# Altium schematic sheet MavSword_V1.0.SchDoc: MavSword
size A2; Author: AwesomeOY; DocumentNumber: 1; Revision: V1.0; SheetNumber: 1; SheetTotal: MavSword
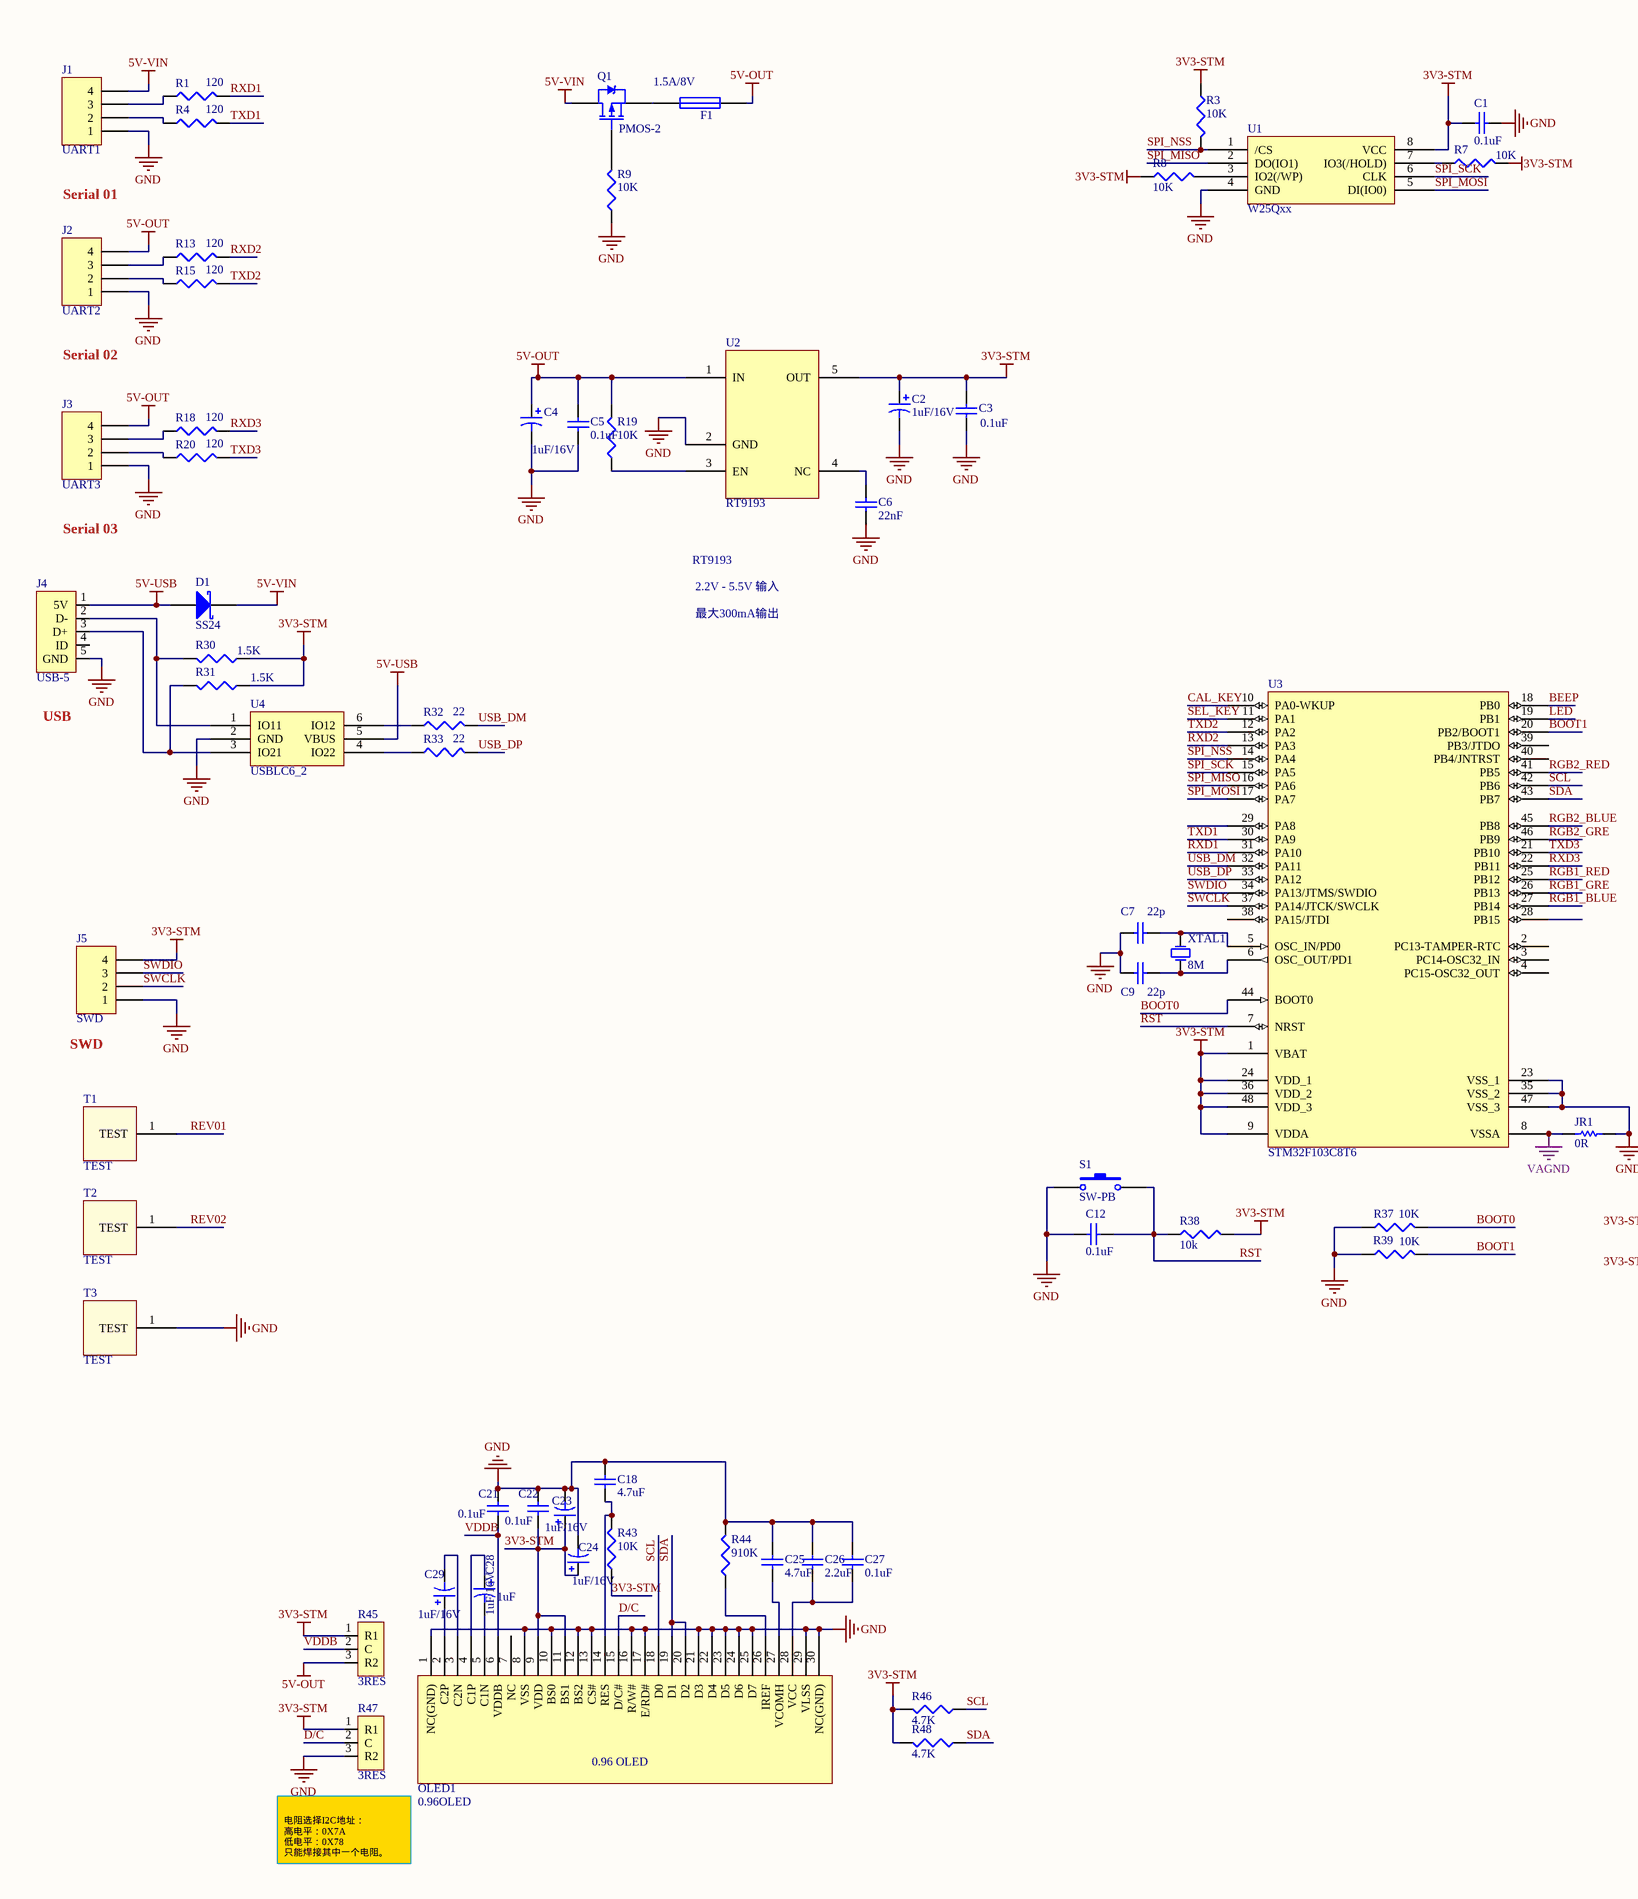
[diagram p0: MavSword_V1.0.SchDoc, left]
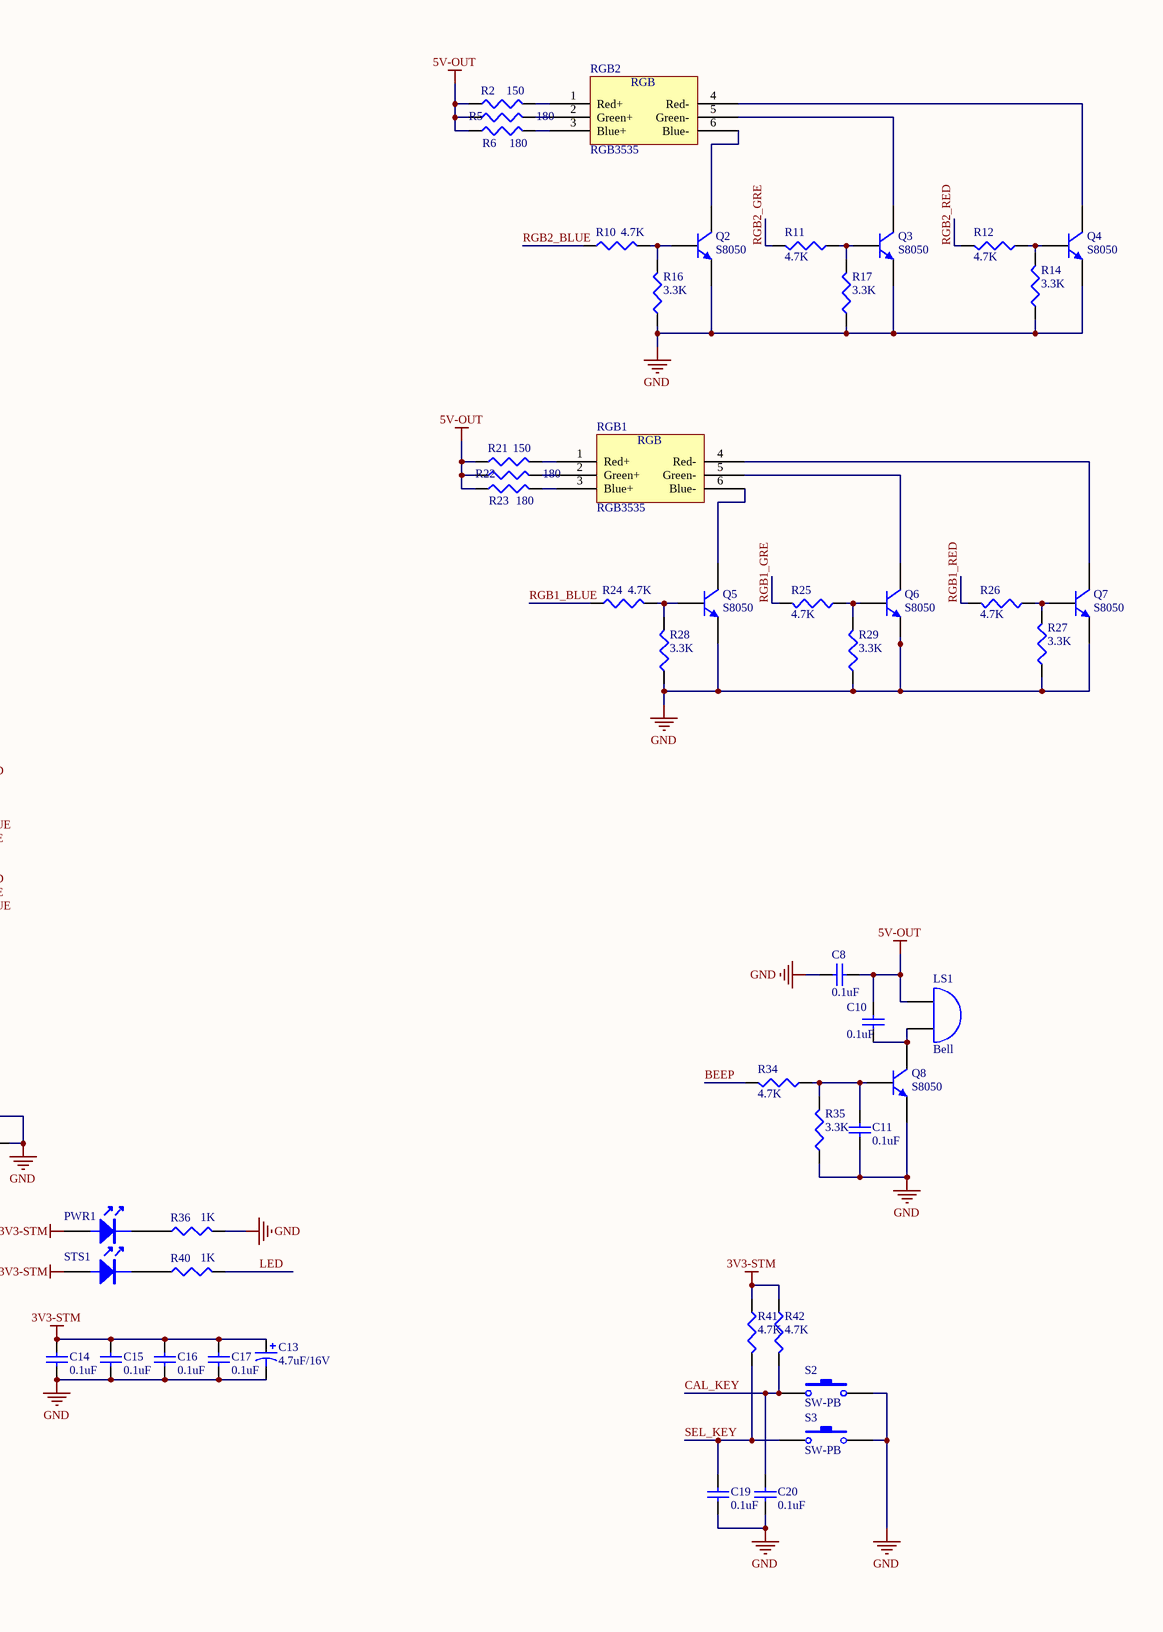
[diagram p1: MavSword_V1.0.SchDoc, right]

## Parts
C1  0.1uF  [C0603B]
C2  1uF/16V  [C0603B]
C3  0.1uF  [C0603B]
C4  1uF/16V  [C0603B]
C5  0.1uF  [C0603B]
C6  22nF  [C0603B]
C7  22p  [C0603B]
C8  0.1uF  [C0603B]
C9  22p  [C0603B]
C10  0.1uF  [C0603B]
C11  0.1uF  [C0603B]
C12  0.1uF  [C0603B]
C13  4.7uF/16V  [C0603B]
C14  0.1uF  [C0603B]
C15  0.1uF  [C0603B]
C16  0.1uF  [C0603B]
C17  0.1uF  [C0603B]
C18  4.7uF  [C0603B]
C19  0.1uF  [C0603B]
C20  0.1uF  [C0603B]
C21  0.1uF  [C0603B]
C22  value 1uF/16V  [C0603B]  (hidden comment: 0.1uF)
C23  0.1uF  [C0603B]
C24  value 1uF/16V  [C0603B]  (hidden comment: Cap Pol1)
C25  4.7uF  [C0603B]
C26  2.2uF  [C0603B]
C27  0.1uF  [C0603B]
C28  1uF  value 1uF/16V  [C0603B]
C29  value 1uF/16V  [C0603B]  (hidden comment: Cap Pol1)
D1  SS24  [D1812]
F1  1.5A/8V  [1812]
J1  UART1  [SIPA4-1.27-SMT-H]
J2  UART2  [SIPA4-1.27-SMT-H]
J3  UART3  [SIPA4-1.27-SMT-H]
J4  USB-5  [MICRO-USB]
J5  SWD  [SIP4-1.27]
JR1  0R  [R0603B]
LS1  Bell  [BEEP12*7.5]
OLED1  0.96OLED  [0.96OLED]
PWR1  LED  [LED0805R]  (value not drawn)
Q1  PMOS-2  [SOT-23-3]
Q2  S8050  [SOT-23-3]
Q3  S8050  [SOT-23-3]
Q4  S8050  [SOT-23-3]
Q5  S8050  [SOT-23-3]
Q6  S8050  [SOT-23-3]
Q7  S8050  [SOT-23-3]
Q8  S8050  [SOT-23-3]
R1  120  [R0603B]
R2  150  [R0603B]
R3  10K  [R0603B]
R4  120  [R0603B]
R5  180  [R0603B]
R6  180  [R0603B]
R7  10K  [R0603B]
R8  10K  [R0603B]
R9  10K  [R0603B]
R10  4.7K  [R0603B]
R11  4.7K  [R0603B]
R12  4.7K  [R0603B]
R13  120  [R0603B]
R14  3.3K  [R0603B]
R15  120  [R0603B]
R16  3.3K  [R0603B]
R17  3.3K  [R0603B]
R18  120  [R0603B]
R19  10K  [R0603B]
R20  120  [R0603B]
R21  150  [R0603B]
R22  180  [R0603B]
R23  180  [R0603B]
R24  4.7K  [R0603B]
R25  4.7K  [R0603B]
R26  4.7K  [R0603B]
R27  3.3K  [R0603B]
R28  3.3K  [R0603B]
R29  3.3K  [R0603B]
R30  1.5K  [R0603B]
R31  1.5K  [R0603B]
R32  22  [R0603B]
R33  22  [R0603B]
R34  4.7K  [R0603B]
R35  3.3K  [R0603B]
R36  1K  [R0603B]
R37  10K  [R0603B]
R38  10k  [R0603B]
R39  10K  [R0603B]
R40  1K  [R0603B]
R41  4.7K  [R0603B]
R42  4.7K  [R0603B]
R43  10K  [R0603B]
R44  910K  [R0603B]
R45  3RES  [3JUMP0603*2]
R46  4.7K  [R0603B]
R47  3RES  [3JUMP0603*2]
R48  4.7K  [R0603B]
RGB1  RGB3535  [RGB3535]
RGB2  RGB3535  [RGB3535]
S1  SW-PB  [SW2PIN_8.2*3.5]
S2  SW-PB  [SW4PIN_9.2*6.15*9]
S3  SW-PB  [SW4PIN_9.2*6.15*9]
STS1  LED  [LED0805G]  (value not drawn)
T1  TEST  [TEST_POINT]
T2  TEST  [TEST_POINT]
T3  TEST  [TEST_POINT]
U1  W25Qxx  [SOIC-8_208mil]
U2  RT9193  [SOT23-5]
U3  STM32F103C8T6  [LQFP48_M_STM32]
U4  USBLC6_2  [SOT-23-6]
XTAL1  8M  [XL5032]

## Nets
3V3-STM: C1.2 C2.1 C3.1 C13.1 C14.2 C15.2 C16.2 C17.2 C22.1 C23.1 C24.1 J5.4 OLED1.9(VDD) OLED1.11(BS1) PWR1.1 R3.1 R7.2 R8.1 R30.1 R31.1 R38.1 R41.1 R42.1 R43.1 R45.1(R1) R46.2 R47.1(R1) R48.2 STS1.1 U1.8(VCC) U2.5(OUT) U3.1(VBAT) U3.9(VDDA) U3.24(VDD_1) U3.36(VDD_2) U3.48(VDD_3)
5V-OUT: C4.1 C5.2 C8.2 C10.2 F1.2 J2.4 J3.4 LS1.1(A) R2.1 R5.1 R6.1 R19.2 R21.1 R22.1 R23.1 R45.3(R2) U2.1(IN)
5V-USB: D1.1(A) J4.1(5V) U4.5(VBUS)
5V-VIN: D1.2(K) J1.4 Q1.2(D)
GND: C1.1 C2.2 C3.2 C4.2 C5.1 C6.1 C7.2 C8.1 C9.2 C11.1 C12.1 C13.2 C14.1 C15.1 C16.1 C17.1 C18.2 C19.1 C20.1 C21.2 C22.2 C23.2 C24.2 C25.2 C26.2 C27.1 J1.1 J2.1 J3.1 J4.5(GND) J5.1 JR1.2 OLED1.1(NC(GND)) OLED1.8(VSS) OLED1.10(BS0) OLED1.12(BS2) OLED1.13(CS#) OLED1.16(R/W#) OLED1.17(E/RD#) OLED1.21(D3) OLED1.22(D4) OLED1.23(D5) OLED1.24(D6) OLED1.25(D7) OLED1.29(VLSS) OLED1.30(NC(GND)) Q2.3(E) Q3.3(E) Q4.3(E) Q5.3(E) Q6.3(E) Q7.3(E) Q8.3(E) R9.1 R14.1 R16.1 R17.1 R27.1 R28.1 R29.1 R35.1 R36.2 R37.1 R39.1 R44.2 R47.3(R2) S1.1 S2.2 S3.2 T3.1(TEST) U1.4(GND) U2.2(GND) U3.23(VSS_1) U3.35(VSS_2) U3.47(VSS_3) U4.2(GND)
VAGND: JR1.1 U3.8(VSSA)
BEEP: R34.2 U3.18(PB0)
BOOT0: R37.2 U3.44(BOOT0)
BOOT1: R39.2 U3.20(PB2/BOOT1)
CAL_KEY: C20.2 R42.2 S2.1 U3.10(PA0-WKUP)
D/C: OLED1.15(D/C#) R47.2(C)
LED: R40.2 U3.19(PB1)
REV01: T1.1(TEST)
REV02: T2.1(TEST)
RGB1_BLUE: R24.1 U3.27(PB14)
RGB1_GRE: R25.2 U3.26(PB13)
RGB1_RED: R26.2 U3.25(PB12)
RGB2_BLUE: R10.1 U3.45(PB8)
RGB2_GRE: R11.2 U3.46(PB9)
RGB2_RED: R12.2 U3.41(PB5)
RST: C12.2 R38.2 S1.2 U3.7(NRST)
RXD1: R1.2 U3.31(PA10)
RXD2: R13.2 U3.13(PA3)
RXD3: R18.2 U3.22(PB11)
SCL: OLED1.18(D0) R46.1 U3.42(PB6)
SDA: OLED1.19(D1) OLED1.20(D2) R48.1 U3.43(PB7)
SEL_KEY: C19.2 R41.2 S3.1 U3.11(PA1)
SPI_MISO: U1.2(DO(IO1)) U3.16(PA6)
SPI_MOSI: U1.5(DI(IO0)) U3.17(PA7)
SPI_NSS: R3.2 U1.1(/CS) U3.14(PA4)
SPI_SCK: U1.6(CLK) U3.15(PA5)
SWCLK: J5.2 U3.37(PA14/JTCK/SWCLK)
SWDIO: J5.3 U3.34(PA13/JTMS/SWDIO)
TXD1: R4.2 U3.30(PA9)
TXD2: R15.2 U3.12(PA2)
TXD3: R20.2 U3.21(PB10)
USB_DM: R32.2 U3.32(PA11)
USB_DP: R33.2 U3.33(PA12)
VDDB: C21.1 OLED1.6(VDDB) R45.2(C)
NetC6_2: C6.2 U2.4(NC)
NetC7_1: C7.1 U3.5(OSC_IN/PD0) XTAL1.2(OSC2)
NetC9_1: C9.1 U3.6(OSC_OUT/PD1) XTAL1.1(OSC1)
NetC10_1: C10.1 LS1.2(B) Q8.2(C)
NetC11_2: C11.2 Q8.1(B) R34.1 R35.2
NetC18_1: C18.1 OLED1.14(RES) R43.2
NetC25_1: C25.1 OLED1.27(VCOMH)
NetC26_1: C26.1 C27.2 OLED1.28(VCC)
NetC28_1: C28.1 OLED1.4(C1P)
NetC28_2: C28.2 OLED1.5(C1N)
NetC29_1: C29.1 OLED1.2(C2P)
NetC29_2: C29.2 OLED1.3(C2N)
NetF1_1: F1.1 Q1.3(S)
NetJ1_2: J1.2 R4.1
NetJ1_3: J1.3 R1.1
NetJ2_2: J2.2 R15.1
NetJ2_3: J2.3 R13.1
NetJ3_2: J3.2 R20.1
NetJ3_3: J3.3 R18.1
NetJ4_2: J4.2(D-) R30.2 U4.1(IO11)
NetJ4_3: J4.3(D+) R31.2 U4.3(IO21)
NetOLED1_26: OLED1.26(IREF) R44.1
NetPWR1_2: PWR1.2 R36.1
NetQ1_1: Q1.1(G) R9.2
NetQ2_1: Q2.1(B) R10.2 R16.2
NetQ2_2: Q2.2(C) RGB2.6(Blue-)
NetQ3_1: Q3.1(B) R11.1 R17.2
NetQ3_2: Q3.2(C) RGB2.5(Green-)
NetQ4_1: Q4.1(B) R12.1 R14.2
NetQ4_2: Q4.2(C) RGB2.4(Red-)
NetQ5_1: Q5.1(B) R24.2 R28.2
NetQ5_2: Q5.2(C) RGB1.6(Blue-)
NetQ6_1: Q6.1(B) R25.1 R29.2
NetQ6_2: Q6.2(C) RGB1.5(Green-)
NetQ7_1: Q7.1(B) R26.1 R27.2
NetQ7_2: Q7.2(C) RGB1.4(Red-)
NetR2_2: R2.2 RGB2.1(Red+)
NetR5_2: R5.2 RGB2.2(Green+)
NetR6_2: R6.2 RGB2.3(Blue+)
NetR7_1: R7.1 U1.7(IO3(/HOLD))
NetR8_2: R8.2 U1.3(IO2(/WP))
NetR19_1: R19.1 U2.3(EN)
NetR21_2: R21.2 RGB1.1(Red+)
NetR22_2: R22.2 RGB1.2(Green+)
NetR23_2: R23.2 RGB1.3(Blue+)
NetR32_1: R32.1 U4.6(IO12)
NetR33_1: R33.1 U4.4(IO22)
NetR40_1: R40.1 STS1.2

Not connected (* = marked no-connect by the designer): J4 4(ID); OLED1 7(NC); U3 2(PC13-TAMPER-RTC) 3(PC14-OSC32_IN) 4(PC15-OSC32_OUT) 28(PB15) 29(PA8) 38(PA15/JTDI) 39(PB3/JTDO) 40(PB4/JNTRST)

## Notes on the sheet
- Serial 01
- Serial 02
- Serial 03
- RT9193
  2.2V - 5.5V 输入
  最大300mA输出
- (near J4) USB
- (near J5) SWD
- (near R47) 电阻选择I2C地址：
  高电平：0X7A
  低电平：0X78
  只能焊接其中一个电阻。
- Title
- Size:
- Date:
- File:
- A2
- Number:
- Time:
- Revision:
- Sheet
- of
- (in symbol 0.96OLED) 0.96 OLED
- (in symbol RGB3535) RGB

## Library data of the parts
C1 C3 C5 C6 C8 C10-C12 C14-C17 C19-C21 C23 C27 = Cap: Capacitor; Published: 8-Jun-2000; LatestRevisionDate: 17-Jul-2002; LatestRevisionNote: Re-released for DXP Platform.; PackageReference: RAD-0.3; Publisher: Altium Limited
  C1 C3 C5 C8 C10-C12 C14-C17 C19-C21 C23 C27: Value: 0.1uF
  C6: Value: 22nF
C2 C4 C13 C22 C24 C28 C29 = Cap Pol1: Polarized Capacitor (Radial); Published: 8-Jun-2000; LatestRevisionDate: 17-Jul-2002; LatestRevisionNote: Re-released for DXP Platform.; PackageReference: RB7.6-15; Publisher: Altium Limited
  C2 C4: Value: 1uF/16V
  C13: Value: 4.7uF/16V
  C22 C24 C28 C29: PackageDescription: Polarized Capacitor (Radial); 2 Leads
C7 C9 = Cap: Capacitor; Value: 22pF; Published: 8-Jun-2000; LatestRevisionDate: 17-Jul-2002; LatestRevisionNote: Re-released for DXP Platform.; PackageReference: RAD-0.3; Publisher: Altium Limited
C18 C25 = Cap: Capacitor; Value: 4.7uF/16V; Published: 8-Jun-2000; LatestRevisionDate: 17-Jul-2002; LatestRevisionNote: Re-released for DXP Platform.; PackageReference: RAD-0.3; Publisher: Altium Limited
C26 = Cap: Capacitor; Value: 2.2uF/16V; Published: 8-Jun-2000; LatestRevisionDate: 17-Jul-2002; LatestRevisionNote: Re-released for DXP Platform.; PackageReference: RAD-0.3; Publisher: Altium Limited
D1 = D Schottky: Schottky Diode; Published: 8-Jun-2000; LatestRevisionDate: 17-Jul-2002; LatestRevisionNote: Re-released for DXP Platform.; PackageReference: SMB; Publisher: Altium Limited; PackageDescription: DO-214-AA/SMB; 2 C-Bend Leads; Body 5.3 x 3.6 mm, inc. leads (LxW); Code_JEDEC: DO-214-AA
F1 = Fuse 1: Fuse; Published: 8-Jun-2000; LatestRevisionDate: 17-Jul-2002; LatestRevisionNote: Re-released for DXP Platform.; PackageReference: PIN-W2/E2.8; Publisher: Altium Limited; PackageDescription: Thru-Hole; 2 Leads
J1-J3 J5 = Header 4: Header, 4-Pin; LatestRevisionDate: 17-Jul-2002; LatestRevisionNote: Re-released for DXP Platform.; Publisher: Altium Limited
J4 = USB5
JR1 = Res1: Resistor; Value: 0; Published: 8-Jun-2000; LatestRevisionDate: 17-Jul-2002; LatestRevisionNote: Re-released for DXP Platform.; PackageReference: AXIAL-0.3; Publisher: Altium Limited; PackageDescription: Axial Device, Thru-Hole; 2 Leads; 0.3 in Pin Spacing
LS1 = Bell: Electrical Bell; Published: 24-Mar-1999; LatestRevisionDate: 17-Jul-2002; LatestRevisionNote: Re-released for DXP Platform.; PackageReference: PIN2; Publisher: Altium Limited
Q1 = PMOS-2: P-Channel Power MOSFET; Note: Pin 4 not drawn and electrically connected to Pin 2.; Published: 8-Jun-2000; LatestRevisionDate: 17-Jul-2002; LatestRevisionNote: Re-released for DXP Platform.; DatasheetVersion: PD-9.390D; PackageVersion: Feb-1997; PackageReference: TO-220AB; Publisher: Altium Limited; PackageDescription: TO, Thru-Hole, Vertical, Heatsink Mounted; 3 In-Line Leads; Pitch 2.54 mm; ComponentLink1Description: Manufacturer Link; ComponentLink1URL: http://www.irf.com/
Q2-Q8 = NPN: NPN Bipolar Transistor; Published: 8-Jun-2000; LatestRevisionDate: 17-Jul-2002; LatestRevisionNote: Re-released for DXP Platform.; PackageReference: TO-226-AA; Publisher: Altium Limited; PackageDescription: TO, Flat Index; 3 In-Line, Axial Leads; Body Dia. 4.8mm; Leads 0.55 x 0.51 mm (max); Code_JEDEC: TO-226-AA
R1-R44 R46 R48 = Res3: Resistor; Published: 8-Jun-2000; LatestRevisionDate: 29-May-2009; LatestRevisionNote: IPC-7351 Footprint Added.; PackageReference: J1-0603; Publisher: Altium Limited; PackageDescription: Chip Resistor
  R1 R4 R13 R15 R18 R20: Value: 120
  R2 R21: Value: 150
  R3 R7-R9 R19 R37-R39 R43: Value: 10K
  R5 R6 R22 R23: Value: 180
  R10-R12 R24-R26 R34 R41 R42 R46 R48: Value: 4.7K
  R14 R16 R17 R27-R29 R35: Value: 3.3K
  R30 R31: Value: 1.5K
  R32 R33: Value: 22
  R36 R40: Value: 1K
  R44: Value: 910K
R45 = 3JumpR: value: 0
R47 = 3JumpR: value: 4.7
S1-S3 = SW-PB: Switch; Published: 24-Mar-1999; LatestRevisionDate: 17-Jul-2002; LatestRevisionNote: Re-released for DXP Platform.; PackageReference: SPST-2; Publisher: Altium Limited; PackageDescription: Switch; 2 Leads
T1-T3 = TEST_POINT
U2 = TLV70033
U3 = STM32F101C8T6: STM32 ARM-based 32-bit MCU with 64 Kbytes Flash, 48-pin LQFP, Industrial Temperature; Published: 30-May-2008; DatasheetVersion: rev6, Mar-2008; PackageVersion: Mar-2008; PackageReference: LQFP48; Publisher: Altium Limited; PackageDescription: 48-Pin Low-Profile Quad Flat Pack, 7 x 7 mm Body, 0.5 mm Pitch (LQFP48); ComponentLink1Description: Manufacturer Link; ComponentLink1URL: www.st.com/stm32; ComponentLink2Description: Datasheet; ComponentLink2URL: http://www.st.com/stonline/products/literature/ds/13586.pdf
XTAL1 = XTAL: Crystal Oscillator; Published: 8-Jun-2000; LatestRevisionDate: 17-Jul-2002; LatestRevisionNote: Re-released for DXP Platform.; PackageReference: R38; Publisher: Altium Limited